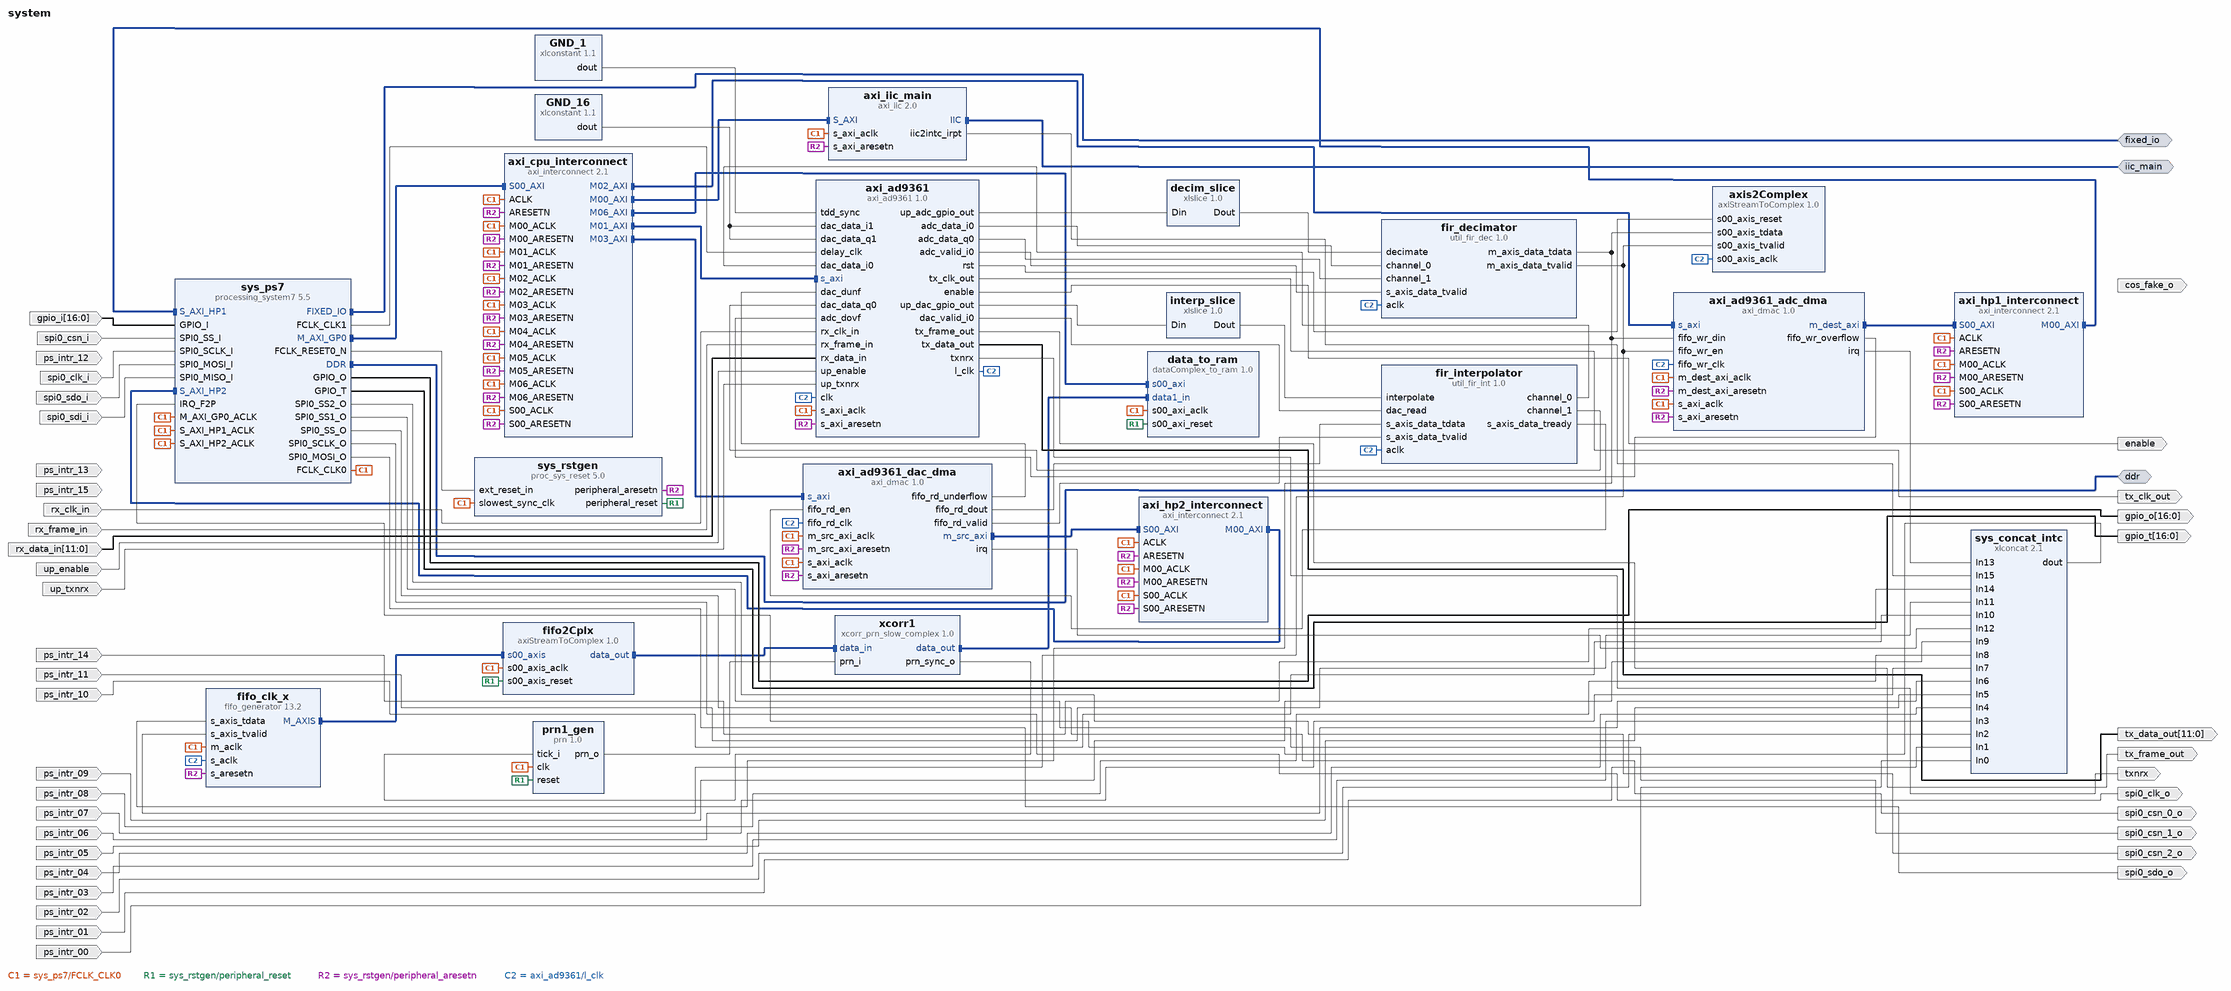
[diagram p0: block diagram of the top level]
# Vivado block design system, xc7z010clg225-1, Vivado 2018.3
create_bd_design system

create_bd_intf_port -mode Master -vlnv xilinx.com:interface:ddrx_rtl:1.0 ddr
create_bd_intf_port -mode Master -vlnv xilinx.com:display_processing_system7:fixedio_rtl:1.0 fixed_io
create_bd_intf_port -mode Master -vlnv xilinx.com:interface:iic_rtl:1.0 iic_main
create_bd_port -dir O spi0_csn_2_o
create_bd_port -dir O spi0_csn_1_o
create_bd_port -dir O spi0_csn_0_o
create_bd_port -dir I spi0_csn_i
create_bd_port -dir I spi0_clk_i
create_bd_port -dir O spi0_clk_o
create_bd_port -dir I spi0_sdo_i
create_bd_port -dir O spi0_sdo_o
create_bd_port -dir I spi0_sdi_i
create_bd_port -dir I -from 16 -to 0 gpio_i
create_bd_port -dir O -from 16 -to 0 gpio_o
create_bd_port -dir O -from 16 -to 0 gpio_t
create_bd_port -dir I -type intr ps_intr_00
create_bd_port -dir I -type intr ps_intr_01
create_bd_port -dir I -type intr ps_intr_02
create_bd_port -dir I -type intr ps_intr_03
create_bd_port -dir I -type intr ps_intr_04
create_bd_port -dir I -type intr ps_intr_05
create_bd_port -dir I -type intr ps_intr_06
create_bd_port -dir I -type intr ps_intr_07
create_bd_port -dir I -type intr ps_intr_08
create_bd_port -dir I -type intr ps_intr_09
create_bd_port -dir I -type intr ps_intr_10
create_bd_port -dir I -type intr ps_intr_11
create_bd_port -dir I -type intr ps_intr_12
create_bd_port -dir I -type intr ps_intr_13
create_bd_port -dir I -type intr ps_intr_14
create_bd_port -dir I -type intr ps_intr_15
create_bd_port -dir I rx_clk_in
create_bd_port -dir I rx_frame_in
create_bd_port -dir I -from 11 -to 0 rx_data_in
create_bd_port -dir O tx_clk_out
create_bd_port -dir O tx_frame_out
create_bd_port -dir O -from 11 -to 0 tx_data_out
create_bd_port -dir O enable
create_bd_port -dir O txnrx
create_bd_port -dir I up_enable
create_bd_port -dir I up_txnrx
create_bd_port -dir O cos_fake_o

create_bd_cell -type ip -vlnv xilinx.com:ip:processing_system7:5.5 sys_ps7
set_property -dict [list \
  CONFIG.PCW_DM_WIDTH 2 \
  CONFIG.PCW_DQS_WIDTH 2 \
  CONFIG.PCW_DQ_WIDTH 16 \
  CONFIG.PCW_EN_CLK1_PORT 1 \
  CONFIG.PCW_EN_RST1_PORT 1 \
  CONFIG.PCW_FCLK_CLK1_BUF TRUE \
  CONFIG.PCW_FPGA0_PERIPHERAL_FREQMHZ 100.0 \
  CONFIG.PCW_FPGA1_PERIPHERAL_FREQMHZ 200.0 \
  CONFIG.PCW_FPGA_FCLK1_ENABLE 1 \
  CONFIG.PCW_GPIO_EMIO_GPIO_ENABLE 1 \
  CONFIG.PCW_GPIO_EMIO_GPIO_IO 17 \
  CONFIG.PCW_GPIO_EMIO_GPIO_WIDTH 17 \
  CONFIG.PCW_GPIO_MIO_GPIO_ENABLE 1 \
  CONFIG.PCW_GPIO_MIO_GPIO_IO MIO \
  CONFIG.PCW_I2C_RESET_ENABLE 1 \
  CONFIG.PCW_IRQ_F2P_INTR 1 \
  CONFIG.PCW_IRQ_F2P_MODE REVERSE \
  CONFIG.PCW_MIO_PRIMITIVE 32 \
  CONFIG.PCW_PRESET_BANK0_VOLTAGE {LVCMOS 1.8V} \
  CONFIG.PCW_PRESET_BANK1_VOLTAGE {LVCMOS 1.8V} \
  CONFIG.PCW_QSPI_GRP_SINGLE_SS_ENABLE 1 \
  CONFIG.PCW_QSPI_GRP_SINGLE_SS_IO {MIO 1 .. 6} \
  CONFIG.PCW_QSPI_PERIPHERAL_ENABLE 1 \
  CONFIG.PCW_QSPI_QSPI_IO {MIO 1 .. 6} \
  CONFIG.PCW_SD0_PERIPHERAL_ENABLE 0 \
  CONFIG.PCW_SINGLE_QSPI_DATA_MODE x4 \
  CONFIG.PCW_SPI0_PERIPHERAL_ENABLE 1 \
  CONFIG.PCW_SPI0_SPI0_IO EMIO \
  CONFIG.PCW_UART1_PERIPHERAL_ENABLE 1 \
  CONFIG.PCW_UART1_UART1_IO {MIO 12 .. 13} \
  CONFIG.PCW_UART_PERIPHERAL_FREQMHZ 100 \
  CONFIG.PCW_UIPARAM_DDR_BUS_WIDTH {16 Bit} \
  CONFIG.PCW_UIPARAM_DDR_PARTNO {MT41K256M16 RE-125} \
  CONFIG.PCW_USB0_PERIPHERAL_ENABLE 1 \
  CONFIG.PCW_USB0_RESET_ENABLE 1 \
  CONFIG.PCW_USB0_RESET_IO {MIO 52} \
  CONFIG.PCW_USB0_USB0_IO {MIO 28 .. 39} \
  CONFIG.PCW_USB_RESET_ENABLE 1 \
  CONFIG.PCW_USB_RESET_SELECT {Share reset pin} \
  CONFIG.PCW_USE_FABRIC_INTERRUPT 1 \
  CONFIG.PCW_USE_S_AXI_HP1 1 \
  CONFIG.PCW_USE_S_AXI_HP2 1 \
] [get_bd_cells sys_ps7]
# 149 more settings of sys_ps7 are not shown: defaults, MIO pin electricals, DDR timing, and values the tool derives
create_bd_cell -type ip -vlnv xilinx.com:ip:xlconcat:2.1 sys_concat_intc
set_property -dict {CONFIG.NUM_PORTS 16} [get_bd_cells sys_concat_intc]
create_bd_cell -type ip -vlnv xilinx.com:ip:proc_sys_reset:5.0 sys_rstgen
set_property -dict {CONFIG.C_EXT_RST_WIDTH 1} [get_bd_cells sys_rstgen]
create_bd_cell -type ip -vlnv xilinx.com:ip:axi_iic:2.0 axi_iic_main
create_bd_cell -type ip -vlnv xilinx.com:ip:axi_interconnect:2.1 axi_cpu_interconnect
set_property -dict {CONFIG.NUM_MI 7} [get_bd_cells axi_cpu_interconnect]
create_bd_cell -type ip -vlnv analog.com:user:axi_ad9361:1.0 axi_ad9361
set_property -dict {CONFIG.ADC_INIT_DELAY 21 CONFIG.CMOS_OR_LVDS_N 1 CONFIG.ID 0 CONFIG.MODE_1R1T 1} [get_bd_cells axi_ad9361]
create_bd_cell -type ip -vlnv analog.com:user:axi_dmac:1.0 axi_ad9361_dac_dma
set_property -dict [list \
  CONFIG.AXI_SLICE_DEST false \
  CONFIG.AXI_SLICE_SRC false \
  CONFIG.CYCLIC true \
  CONFIG.DMA_2D_TRANSFER false \
  CONFIG.DMA_DATA_WIDTH_DEST 32 \
  CONFIG.DMA_TYPE_DEST 2 \
  CONFIG.DMA_TYPE_SRC 0 \
] [get_bd_cells axi_ad9361_dac_dma]
create_bd_cell -type ip -vlnv analog.com:user:util_fir_int:1.0 fir_interpolator
create_bd_cell -type ip -vlnv xilinx.com:ip:xlslice:1.0 interp_slice
create_bd_cell -type ip -vlnv analog.com:user:axi_dmac:1.0 axi_ad9361_adc_dma
set_property -dict [list \
  CONFIG.AXI_SLICE_DEST false \
  CONFIG.AXI_SLICE_SRC false \
  CONFIG.CYCLIC false \
  CONFIG.DMA_2D_TRANSFER false \
  CONFIG.DMA_DATA_WIDTH_SRC 32 \
  CONFIG.DMA_TYPE_DEST 0 \
  CONFIG.DMA_TYPE_SRC 2 \
  CONFIG.SYNC_TRANSFER_START false \
] [get_bd_cells axi_ad9361_adc_dma]
create_bd_cell -type ip -vlnv analog.com:user:util_fir_dec:1.0 fir_decimator
create_bd_cell -type ip -vlnv xilinx.com:ip:xlslice:1.0 decim_slice
create_bd_cell -type ip -vlnv xilinx.com:ip:xlconstant:1.1 GND_1
set_property -dict {CONFIG.CONST_VAL 0 CONFIG.CONST_WIDTH 1} [get_bd_cells GND_1]
create_bd_cell -type ip -vlnv xilinx.com:ip:xlconstant:1.1 GND_16
set_property -dict {CONFIG.CONST_VAL 0 CONFIG.CONST_WIDTH 16} [get_bd_cells GND_16]
create_bd_cell -type ip -vlnv xilinx.com:ip:axi_interconnect:2.1 axi_hp1_interconnect
set_property -dict {CONFIG.NUM_MI 1 CONFIG.NUM_SI 1} [get_bd_cells axi_hp1_interconnect]
create_bd_cell -type ip -vlnv xilinx.com:ip:axi_interconnect:2.1 axi_hp2_interconnect
set_property -dict {CONFIG.NUM_MI 1 CONFIG.NUM_SI 1} [get_bd_cells axi_hp2_interconnect]
create_bd_cell -type ip -vlnv ggm:cogen:axiStreamToComplex:1.0 axis2Complex
set_property -dict {CONFIG.DATA_SIZE 16} [get_bd_cells axis2Complex]
create_bd_cell -type ip -vlnv xilinx.com:ip:fifo_generator:13.2 fifo_clk_x
set_property -dict [list \
  CONFIG.Clock_Type_AXI Independent_Clock \
  CONFIG.FIFO_Implementation_axis Independent_Clocks_Block_RAM \
  CONFIG.FIFO_Implementation_rach Independent_Clocks_Distributed_RAM \
  CONFIG.FIFO_Implementation_rdch Independent_Clocks_Block_RAM \
  CONFIG.FIFO_Implementation_wach Independent_Clocks_Distributed_RAM \
  CONFIG.FIFO_Implementation_wdch Independent_Clocks_Block_RAM \
  CONFIG.FIFO_Implementation_wrch Independent_Clocks_Distributed_RAM \
  CONFIG.Full_Flags_Reset_Value 1 \
  CONFIG.HAS_ACLKEN false \
  CONFIG.INTERFACE_TYPE AXI_STREAM \
  CONFIG.Input_Depth_axis 16 \
  CONFIG.TDATA_NUM_BYTES 4 \
  CONFIG.TUSER_WIDTH 0 \
] [get_bd_cells fifo_clk_x]
create_bd_cell -type ip -vlnv ggm:cogen:axiStreamToComplex:1.0 fifo2Cplx
set_property -dict {CONFIG.DATA_SIZE 16} [get_bd_cells fifo2Cplx]
create_bd_cell -type ip -vlnv ggm:cogen:prn:1.0 prn1_gen
set_property -dict {CONFIG.BIT_LEN 7 CONFIG.PERIOD_LEN 1 CONFIG.PRN_NUM 1} [get_bd_cells prn1_gen]
create_bd_cell -type ip -vlnv ggm:cogen:xcorr_prn_slow_complex:1.0 xcorr1
set_property -dict {CONFIG.IN_SIZE 16 CONFIG.LENGTH 127 CONFIG.NB_BLK 1 CONFIG.OUT_SIZE 32} [get_bd_cells xcorr1]
create_bd_cell -type ip -vlnv ggm:cogen:dataComplex_to_ram:1.0 data_to_ram
set_property -dict {CONFIG.DATA_SIZE 32 CONFIG.NB_INPUT 1 CONFIG.NB_SAMPLE 2048} [get_bd_cells data_to_ram]

# ---- connections ----

connect_bd_intf_net [get_bd_intf_ports iic_main] [get_bd_intf_pins axi_iic_main/IIC]
connect_bd_intf_net [get_bd_intf_pins axi_cpu_interconnect/S00_AXI] [get_bd_intf_pins sys_ps7/M_AXI_GP0]
connect_bd_intf_net [get_bd_intf_pins fifo_clk_x/M_AXIS] [get_bd_intf_pins fifo2Cplx/s00_axis]
connect_bd_intf_net [get_bd_intf_pins axi_cpu_interconnect/M00_AXI] [get_bd_intf_pins axi_iic_main/S_AXI]
connect_bd_intf_net [get_bd_intf_pins axi_cpu_interconnect/M06_AXI] [get_bd_intf_pins data_to_ram/s00_axi]
connect_bd_intf_net [get_bd_intf_pins axi_cpu_interconnect/M03_AXI] [get_bd_intf_pins axi_ad9361_dac_dma/s_axi]
connect_bd_intf_net [get_bd_intf_ports fixed_io] [get_bd_intf_pins sys_ps7/FIXED_IO]
connect_bd_intf_net [get_bd_intf_pins xcorr1/data_out] [get_bd_intf_pins data_to_ram/data1_in]
connect_bd_intf_net [get_bd_intf_pins axi_cpu_interconnect/M02_AXI] [get_bd_intf_pins axi_ad9361_adc_dma/s_axi]
connect_bd_intf_net [get_bd_intf_pins axi_hp1_interconnect/M00_AXI] [get_bd_intf_pins sys_ps7/S_AXI_HP1]
connect_bd_intf_net [get_bd_intf_pins axi_hp1_interconnect/S00_AXI] [get_bd_intf_pins axi_ad9361_adc_dma/m_dest_axi]
connect_bd_intf_net [get_bd_intf_pins axi_cpu_interconnect/M01_AXI] [get_bd_intf_pins axi_ad9361/s_axi]
connect_bd_intf_net [get_bd_intf_ports ddr] [get_bd_intf_pins sys_ps7/DDR]
connect_bd_intf_net [get_bd_intf_pins axi_hp2_interconnect/M00_AXI] [get_bd_intf_pins sys_ps7/S_AXI_HP2]
connect_bd_intf_net [get_bd_intf_pins axi_hp2_interconnect/S00_AXI] [get_bd_intf_pins axi_ad9361_dac_dma/m_src_axi]
connect_bd_intf_net [get_bd_intf_pins fifo2Cplx/data_out] [get_bd_intf_pins xcorr1/data_in]
connect_bd_net -net sys_cpu_clk [get_bd_pins sys_ps7/FCLK_CLK0] \
  [get_bd_pins sys_rstgen/slowest_sync_clk] [get_bd_pins sys_ps7/M_AXI_GP0_ACLK] [get_bd_pins axi_cpu_interconnect/ACLK] \
  [get_bd_pins axi_cpu_interconnect/S00_ACLK] [get_bd_pins axi_cpu_interconnect/M00_ACLK] \
  [get_bd_pins axi_iic_main/s_axi_aclk] [get_bd_pins axi_cpu_interconnect/M01_ACLK] [get_bd_pins axi_ad9361/s_axi_aclk] \
  [get_bd_pins axi_cpu_interconnect/M02_ACLK] [get_bd_pins axi_ad9361_adc_dma/s_axi_aclk] \
  [get_bd_pins axi_cpu_interconnect/M03_ACLK] [get_bd_pins axi_ad9361_dac_dma/s_axi_aclk] \
  [get_bd_pins axi_hp1_interconnect/ACLK] [get_bd_pins axi_hp1_interconnect/M00_ACLK] [get_bd_pins sys_ps7/S_AXI_HP1_ACLK] \
  [get_bd_pins axi_hp1_interconnect/S00_ACLK] [get_bd_pins axi_ad9361_adc_dma/m_dest_axi_aclk] \
  [get_bd_pins axi_hp2_interconnect/ACLK] [get_bd_pins axi_hp2_interconnect/M00_ACLK] [get_bd_pins sys_ps7/S_AXI_HP2_ACLK] \
  [get_bd_pins axi_hp2_interconnect/S00_ACLK] [get_bd_pins axi_ad9361_dac_dma/m_src_axi_aclk] \
  [get_bd_pins axi_cpu_interconnect/M04_ACLK] [get_bd_pins axi_cpu_interconnect/M05_ACLK] [get_bd_pins fifo_clk_x/m_aclk] \
  [get_bd_pins fifo2Cplx/s00_axis_aclk] [get_bd_pins prn1_gen/clk] [get_bd_pins axi_cpu_interconnect/M06_ACLK] \
  [get_bd_pins data_to_ram/s00_axi_aclk]
connect_bd_net -net sys_200m_clk [get_bd_pins sys_ps7/FCLK_CLK1] [get_bd_pins axi_ad9361/delay_clk]
connect_bd_net -net sys_cpu_reset [get_bd_pins sys_rstgen/peripheral_reset] \
  [get_bd_pins fifo2Cplx/s00_axis_reset] [get_bd_pins prn1_gen/reset] [get_bd_pins data_to_ram/s00_axi_reset]
connect_bd_net -net sys_cpu_resetn [get_bd_pins sys_rstgen/peripheral_aresetn] \
  [get_bd_pins axi_cpu_interconnect/ARESETN] [get_bd_pins axi_cpu_interconnect/S00_ARESETN] \
  [get_bd_pins axi_cpu_interconnect/M00_ARESETN] [get_bd_pins axi_iic_main/s_axi_aresetn] \
  [get_bd_pins axi_cpu_interconnect/M01_ARESETN] [get_bd_pins axi_ad9361/s_axi_aresetn] \
  [get_bd_pins axi_cpu_interconnect/M02_ARESETN] [get_bd_pins axi_ad9361_adc_dma/s_axi_aresetn] \
  [get_bd_pins axi_cpu_interconnect/M03_ARESETN] [get_bd_pins axi_ad9361_dac_dma/s_axi_aresetn] \
  [get_bd_pins axi_hp1_interconnect/ARESETN] [get_bd_pins axi_hp1_interconnect/M00_ARESETN] \
  [get_bd_pins axi_hp1_interconnect/S00_ARESETN] [get_bd_pins axi_hp2_interconnect/ARESETN] \
  [get_bd_pins axi_hp2_interconnect/M00_ARESETN] [get_bd_pins axi_hp2_interconnect/S00_ARESETN] \
  [get_bd_pins axi_ad9361_adc_dma/m_dest_axi_aresetn] [get_bd_pins axi_ad9361_dac_dma/m_src_axi_aresetn] \
  [get_bd_pins axi_cpu_interconnect/M04_ARESETN] [get_bd_pins axi_cpu_interconnect/M05_ARESETN] \
  [get_bd_pins fifo_clk_x/s_aresetn] [get_bd_pins axi_cpu_interconnect/M06_ARESETN]
connect_bd_net [get_bd_pins sys_ps7/FCLK_RESET0_N] [get_bd_pins sys_rstgen/ext_reset_in]
connect_bd_net [get_bd_ports gpio_i] [get_bd_pins sys_ps7/GPIO_I]
connect_bd_net [get_bd_pins sys_ps7/GPIO_O] [get_bd_ports gpio_o]
connect_bd_net [get_bd_pins sys_ps7/GPIO_T] [get_bd_ports gpio_t]
connect_bd_net [get_bd_pins sys_ps7/SPI0_SS2_O] [get_bd_ports spi0_csn_2_o]
connect_bd_net [get_bd_pins sys_ps7/SPI0_SS1_O] [get_bd_ports spi0_csn_1_o]
connect_bd_net [get_bd_pins sys_ps7/SPI0_SS_O] [get_bd_ports spi0_csn_0_o]
connect_bd_net [get_bd_ports spi0_csn_i] [get_bd_pins sys_ps7/SPI0_SS_I]
connect_bd_net [get_bd_ports spi0_clk_i] [get_bd_pins sys_ps7/SPI0_SCLK_I]
connect_bd_net [get_bd_pins sys_ps7/SPI0_SCLK_O] [get_bd_ports spi0_clk_o]
connect_bd_net [get_bd_ports spi0_sdo_i] [get_bd_pins sys_ps7/SPI0_MOSI_I]
connect_bd_net [get_bd_pins sys_ps7/SPI0_MOSI_O] [get_bd_ports spi0_sdo_o]
connect_bd_net [get_bd_ports spi0_sdi_i] [get_bd_pins sys_ps7/SPI0_MISO_I]
connect_bd_net [get_bd_pins sys_concat_intc/dout] [get_bd_pins sys_ps7/IRQ_F2P]
# net ps_intr_15_1 has one end: ps_intr_15
connect_bd_net -net ps_intr_14_1 [get_bd_ports ps_intr_14] [get_bd_pins sys_concat_intc/In14]
# net ps_intr_13_1 has one end: ps_intr_13
# net ps_intr_12_1 has one end: ps_intr_12
connect_bd_net -net ps_intr_11_1 [get_bd_ports ps_intr_11] [get_bd_pins sys_concat_intc/In11]
connect_bd_net -net ps_intr_10_1 [get_bd_ports ps_intr_10] [get_bd_pins sys_concat_intc/In10]
connect_bd_net -net ps_intr_09_1 [get_bd_ports ps_intr_09] [get_bd_pins sys_concat_intc/In9]
connect_bd_net -net ps_intr_08_1 [get_bd_ports ps_intr_08] [get_bd_pins sys_concat_intc/In8]
connect_bd_net -net ps_intr_07_1 [get_bd_ports ps_intr_07] [get_bd_pins sys_concat_intc/In7]
connect_bd_net -net ps_intr_06_1 [get_bd_ports ps_intr_06] [get_bd_pins sys_concat_intc/In6]
connect_bd_net -net ps_intr_05_1 [get_bd_ports ps_intr_05] [get_bd_pins sys_concat_intc/In5]
connect_bd_net -net ps_intr_04_1 [get_bd_ports ps_intr_04] [get_bd_pins sys_concat_intc/In4]
connect_bd_net -net ps_intr_03_1 [get_bd_ports ps_intr_03] [get_bd_pins sys_concat_intc/In3]
connect_bd_net -net ps_intr_02_1 [get_bd_ports ps_intr_02] [get_bd_pins sys_concat_intc/In2]
connect_bd_net -net ps_intr_01_1 [get_bd_ports ps_intr_01] [get_bd_pins sys_concat_intc/In1]
connect_bd_net -net ps_intr_00_1 [get_bd_ports ps_intr_00] [get_bd_pins sys_concat_intc/In0]
connect_bd_net [get_bd_pins axi_iic_main/iic2intc_irpt] [get_bd_pins sys_concat_intc/In15]
connect_bd_net [get_bd_ports rx_clk_in] [get_bd_pins axi_ad9361/rx_clk_in]
connect_bd_net [get_bd_ports rx_frame_in] [get_bd_pins axi_ad9361/rx_frame_in]
connect_bd_net [get_bd_ports rx_data_in] [get_bd_pins axi_ad9361/rx_data_in]
connect_bd_net [get_bd_pins axi_ad9361/tx_clk_out] [get_bd_ports tx_clk_out]
connect_bd_net [get_bd_pins axi_ad9361/tx_frame_out] [get_bd_ports tx_frame_out]
connect_bd_net [get_bd_pins axi_ad9361/tx_data_out] [get_bd_ports tx_data_out]
connect_bd_net [get_bd_pins axi_ad9361/enable] [get_bd_ports enable]
connect_bd_net [get_bd_pins axi_ad9361/txnrx] [get_bd_ports txnrx]
connect_bd_net [get_bd_ports up_enable] [get_bd_pins axi_ad9361/up_enable]
connect_bd_net [get_bd_ports up_txnrx] [get_bd_pins axi_ad9361/up_txnrx]
connect_bd_net [get_bd_pins GND_1/dout] [get_bd_pins axi_ad9361/tdd_sync]
connect_bd_net [get_bd_pins axi_ad9361/l_clk] \
  [get_bd_pins axi_ad9361/clk] [get_bd_pins fir_decimator/aclk] [get_bd_pins fir_interpolator/aclk] \
  [get_bd_pins axi_ad9361_adc_dma/fifo_wr_clk] [get_bd_pins axi_ad9361_dac_dma/fifo_rd_clk] \
  [get_bd_pins axis2Complex/s00_axis_aclk] [get_bd_pins fifo_clk_x/s_aclk]
connect_bd_net [get_bd_pins axi_ad9361/adc_data_i0] [get_bd_pins fir_decimator/channel_0]
connect_bd_net [get_bd_pins axi_ad9361/adc_data_q0] [get_bd_pins fir_decimator/channel_1]
connect_bd_net [get_bd_pins axi_ad9361/adc_valid_i0] [get_bd_pins fir_decimator/s_axis_data_tvalid]
connect_bd_net [get_bd_pins fir_decimator/m_axis_data_tdata] \
  [get_bd_pins axi_ad9361_adc_dma/fifo_wr_din] [get_bd_pins axis2Complex/s00_axis_tdata] \
  [get_bd_pins fifo_clk_x/s_axis_tdata]
connect_bd_net [get_bd_pins fir_decimator/m_axis_data_tvalid] \
  [get_bd_pins axi_ad9361_adc_dma/fifo_wr_en] [get_bd_pins axis2Complex/s00_axis_tvalid] \
  [get_bd_pins fifo_clk_x/s_axis_tvalid]
connect_bd_net [get_bd_pins axi_ad9361/up_adc_gpio_out] [get_bd_pins decim_slice/Din]
connect_bd_net [get_bd_pins decim_slice/Dout] [get_bd_pins fir_decimator/decimate]
connect_bd_net [get_bd_pins axi_ad9361_dac_dma/fifo_rd_dout] [get_bd_pins fir_interpolator/s_axis_data_tdata]
connect_bd_net [get_bd_pins axi_ad9361_dac_dma/fifo_rd_valid] [get_bd_pins fir_interpolator/s_axis_data_tvalid]
connect_bd_net [get_bd_pins axi_ad9361/dac_valid_i0] [get_bd_pins fir_interpolator/dac_read]
connect_bd_net [get_bd_pins fir_interpolator/s_axis_data_tready] [get_bd_pins axi_ad9361_dac_dma/fifo_rd_en]
connect_bd_net [get_bd_pins fir_interpolator/channel_0] [get_bd_pins axi_ad9361/dac_data_i0]
connect_bd_net [get_bd_pins fir_interpolator/channel_1] [get_bd_pins axi_ad9361/dac_data_q0]
connect_bd_net [get_bd_pins axi_ad9361/up_dac_gpio_out] [get_bd_pins interp_slice/Din]
connect_bd_net [get_bd_pins interp_slice/Dout] [get_bd_pins fir_interpolator/interpolate]
connect_bd_net [get_bd_pins axi_ad9361_adc_dma/fifo_wr_overflow] [get_bd_pins axi_ad9361/adc_dovf]
connect_bd_net [get_bd_pins axi_ad9361_dac_dma/fifo_rd_underflow] [get_bd_pins axi_ad9361/dac_dunf]
connect_bd_net [get_bd_pins GND_16/dout] [get_bd_pins axi_ad9361/dac_data_i1] [get_bd_pins axi_ad9361/dac_data_q1]
connect_bd_net [get_bd_pins axi_ad9361_adc_dma/irq] [get_bd_pins sys_concat_intc/In13]
connect_bd_net [get_bd_pins axi_ad9361_dac_dma/irq] [get_bd_pins sys_concat_intc/In12]
connect_bd_net [get_bd_pins axi_ad9361/rst] [get_bd_pins axis2Complex/s00_axis_reset]
connect_bd_net [get_bd_pins prn1_gen/prn_o] [get_bd_pins xcorr1/prn_i]
connect_bd_net [get_bd_pins xcorr1/prn_sync_o] [get_bd_pins prn1_gen/tick_i]

# ---- address map ----
assign_bd_address -offset 0x00000000 -range 512M -target_address_space [get_bd_addr_spaces axi_ad9361_adc_dma/m_dest_axi] [get_bd_addr_segs sys_ps7/S_AXI_HP1/HP1_DDR_LOWOCM]
assign_bd_address -offset 0x00000000 -range 512M -target_address_space [get_bd_addr_spaces axi_ad9361_dac_dma/m_src_axi] [get_bd_addr_segs sys_ps7/S_AXI_HP2/HP2_DDR_LOWOCM]
assign_bd_address -offset 0x41600000 -range 4K -target_address_space [get_bd_addr_spaces sys_ps7/Data] [get_bd_addr_segs axi_iic_main/S_AXI/Reg]
assign_bd_address -offset 0x43C20000 -range 4K -target_address_space [get_bd_addr_spaces sys_ps7/Data] [get_bd_addr_segs data_to_ram/s00_axi/reg0]
assign_bd_address -offset 0x79020000 -range 64K -target_address_space [get_bd_addr_spaces sys_ps7/Data] [get_bd_addr_segs axi_ad9361/s_axi/axi_lite]
assign_bd_address -offset 0x7C400000 -range 4K -target_address_space [get_bd_addr_spaces sys_ps7/Data] [get_bd_addr_segs axi_ad9361_adc_dma/s_axi/axi_lite]
assign_bd_address -offset 0x7C420000 -range 4K -target_address_space [get_bd_addr_spaces sys_ps7/Data] [get_bd_addr_segs axi_ad9361_dac_dma/s_axi/axi_lite]

validate_bd_design
save_bd_design
